# Altium project IR_Sensor_Array.PrjPcb
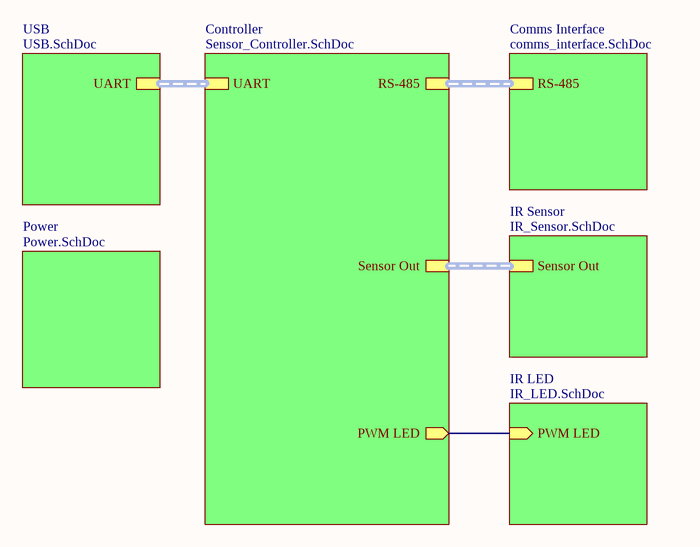
[diagram p0: root.SchDoc]
6 sheets, 81 parts. Net scope: hierarchical (ports join the sheet entries above them; power ports are global).
Board file: PCB.PcbDoc
Sheets:
  root.SchDoc
    Controller = Sensor_Controller.SchDoc
    IR LED = IR_LED.SchDoc
    IR Sensor = IR_Sensor.SchDoc
    Comms Interface = comms_interface.SchDoc
    Power = Power.SchDoc

## Sheet root.SchDoc
size A4; SheetNumber: 1; SheetTotal: 7

### Sub-sheets
Comms Interface = comms_interface.SchDoc: RS-485
Controller = Sensor_Controller.SchDoc: RS-485, Sensor Out, UART, PWM LED (out)
IR LED = IR_LED.SchDoc: PWM LED (in)
IR Sensor = IR_Sensor.SchDoc: Sensor Out
Power = Power.SchDoc: no entries
USB = USB.SchDoc (file not in this document): UART

### Nets
PWM LED: sheet Controller/PWM LED, sheet IR LED/PWM LED

### Buses and harness runs
harness sheet Comms Interface/RS-485 = sheet Controller/RS-485
harness sheet Controller/Sensor Out = sheet IR Sensor/Sensor Out
harness sheet Controller/UART = sheet USB/UART

## Sheet Sensor_Controller.SchDoc
size A4; SheetNumber: 2; SheetTotal: 7
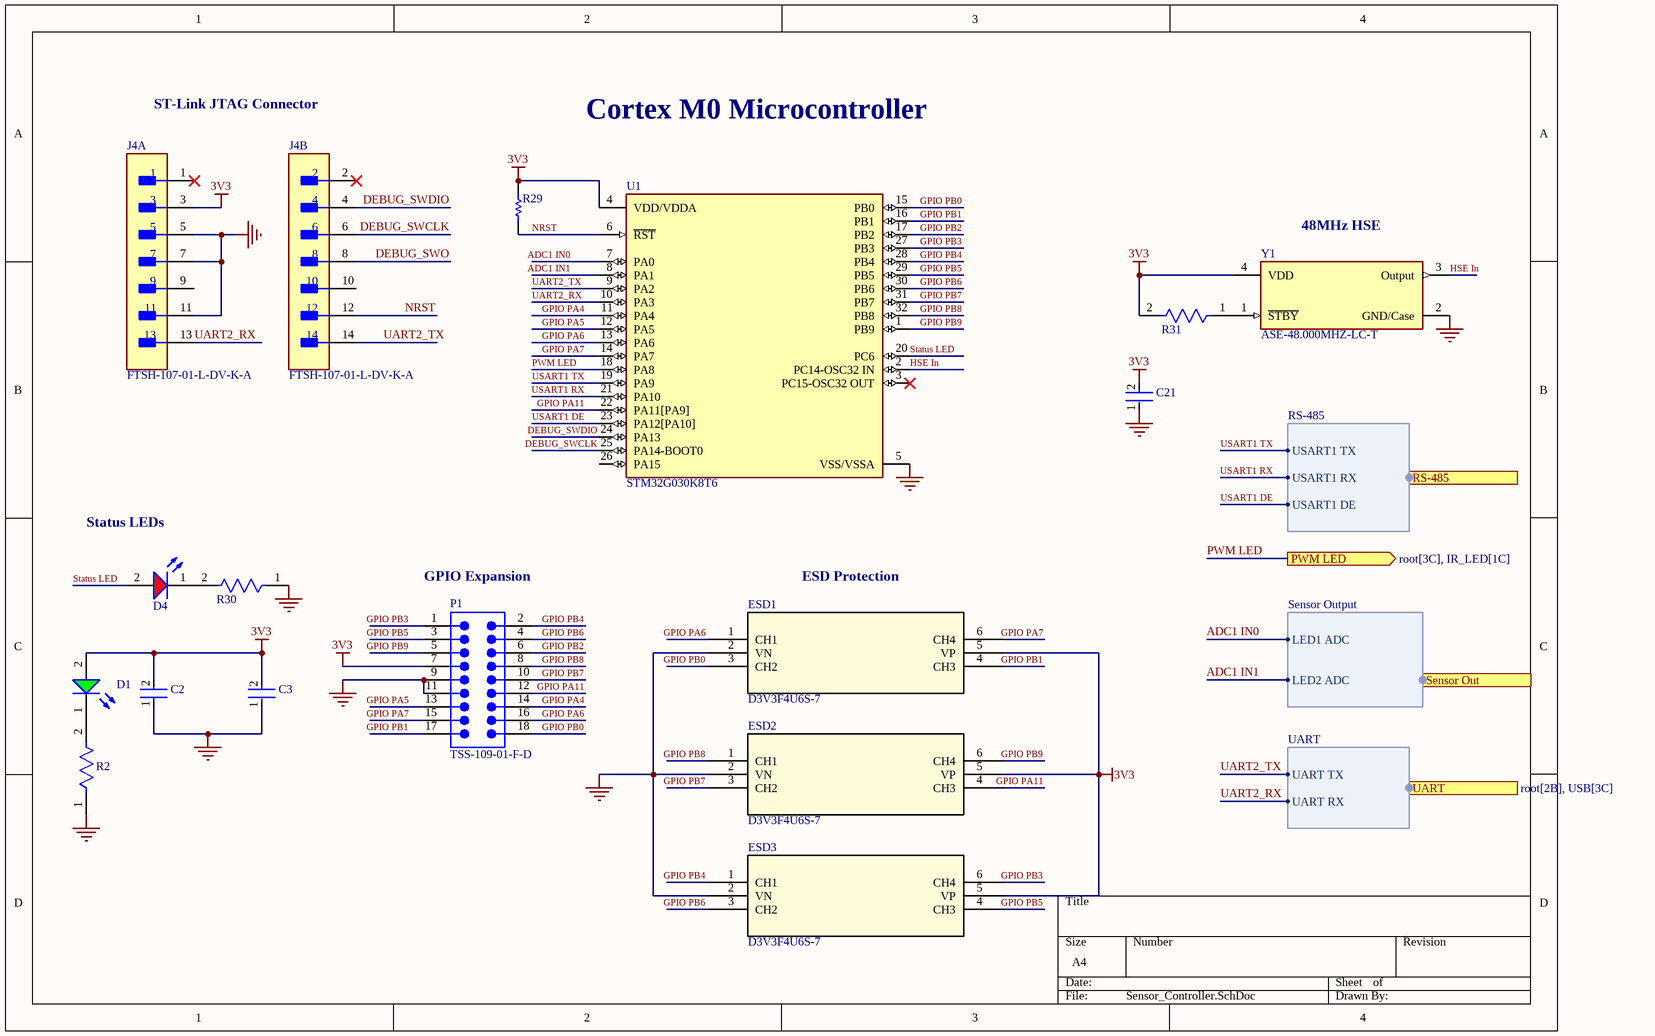
[diagram p1: Sensor_Controller.SchDoc]

### Parts
C2  GRM188R6YA475KE15D  [FP-GRM188-0_2-IPC_C]  (value not drawn)
C3  GRM155R71C104KA88D  [FP-GRM15-MFG]  (value not drawn)
C21  GRM155R71C104KA88D  [FP-GRM15-MFG]  (value not drawn)
D1  150060VS75000  [WL-SMCW_0603_150060xx75000]  (value not drawn)
D4  150060SS75000  [WL-SMCW_0603_150060xx75000]  (value not drawn)
ESD1  D3V3F4U6S-7  [SOT-363_DIO]
ESD2  D3V3F4U6S-7  [SOT-363_DIO]
ESD3  D3V3F4U6S-7  [SOT-363_DIO]
J4  FTSH-107-01-L-DV-K-A  [FP-FTSH-107-01-L-DV-K-A-MFG]  (parts A,B of 2)
P1  TSS-109-01-F-D  [SMTC-TSS-109-01-X-D]
R2  RC0603FR-0710KL  [FP-RC0603-0_55-IPC_C]  (value not drawn)
R29  TNPW040210K0DEED  [RESC1005X40X20NL05T10]  (value not drawn)
R30  RC0603FR-0710KL  [FP-RC0603-0_55-IPC_C]  (value not drawn)
R31  RC0603FR-0710KL  [FP-RC0603-0_55-IPC_C]  (value not drawn)
U1  STM32G030K8T6  [FP-LQFP32-5V-IPC_A]
Y1  ASE-48.000MHZ-LC-T  [FP-ASE-MFG]

### Ports
PWM LED (out, see root[3C], IR_LED[1C]), RS-485 (harness RS-485, see root[3B], comms_interface[1D]), Sensor Out (harness Sensor Output, see root[3B], IR_Sensor[1C]), UART (harness UART, see root[2B], USB[3C])

### Harnesses
Sensor Output: LED1 ADC, LED2 ADC
RS-485: USART1 TX, USART1 RX, USART1 DE
UART: UART TX, UART RX

### Nets
3V3: C2.2 C3.2 C21.2 D1.2(A) ESD1.5(VP) ESD2.5(VP) ESD3.5(VP) J4.3 P1.7 R29.2 R31.2 U1.4(VDD/VDDA) Y1.4(VDD)
GND: C2.1 C3.1 C21.1 ESD1.2(VN) ESD2.2(VN) ESD3.2(VN) J4.5 J4.7 J4.11 P1.9 P1.11 R2.1 R30.1 U1.5(VSS/VSSA) Y1.2(GND/Case)
ADC1 IN0: U1.7(PA0) ; port Sensor Out.LED1 ADC
ADC1 IN1: U1.8(PA1) ; port Sensor Out.LED2 ADC
DEBUG_SWCLK: J4.6 U1.25(PA14-BOOT0)
DEBUG_SWDIO: J4.4 U1.24(PA13)
DEBUG_SWO: J4.8
GPIO PA4: P1.14 U1.11(PA4)
GPIO PA5: P1.13 U1.12(PA5)
GPIO PA6: ESD1.1(CH1) P1.16 U1.13(PA6)
GPIO PA7: ESD1.6(CH4) P1.15 U1.14(PA7)
GPIO PA11: ESD2.4(CH3) P1.12 U1.22(PA11[PA9])
GPIO PB0: ESD1.3(CH2) P1.18 U1.15(PB0)
GPIO PB1: ESD1.4(CH3) P1.17 U1.16(PB1)
GPIO PB2: P1.6 U1.17(PB2)
GPIO PB3: ESD3.6(CH4) P1.1 U1.27(PB3)
GPIO PB4: ESD3.1(CH1) P1.2 U1.28(PB4)
GPIO PB5: ESD3.4(CH3) P1.3 U1.29(PB5)
GPIO PB6: ESD3.3(CH2) P1.4 U1.30(PB6)
GPIO PB7: ESD2.3(CH2) P1.10 U1.31(PB7)
GPIO PB8: ESD2.1(CH1) P1.8 U1.32(PB8)
GPIO PB9: ESD2.6(CH4) P1.5 U1.1(PB9)
HSE In: U1.2(PC14-OSC32_IN) Y1.3(Output)
NRST: J4.12 R29.1 U1.6(~{RST})
PWM LED: U1.18(PA8) ; port PWM LED
Status LED: D4.2(A) U1.20(PC6)
UART2_RX: J4.13 U1.10(PA3) ; port UART.UART RX
UART2_TX: J4.14 U1.9(PA2) ; port UART.UART TX
USART1 DE: U1.23(PA12[PA10]) ; port RS-485.USART1 DE  [project net TX EN]
USART1 RX: U1.21(PA10) ; port RS-485.USART1 RX  [project net RX]
USART1 TX: U1.19(PA9) ; port RS-485.USART1 TX  [project net TX]
NetD1_1: D1.1(K) R2.2
NetD4_1: D4.1(K) R30.2
NetR31_1: R31.1 Y1.1(~{STBY})

Not connected (* = marked no-connect by the designer): J4 1* 2* 9 10; U1 3(PC15-OSC32_OUT)* 26(PA15)

### Notes on the sheet
- ST-Link JTAG Connector
- Cortex M0 Microcontroller
- (near Y1) 48MHz HSE
- Status LEDs
- (near P1) GPIO Expansion
- ESD Protection

### Library data of the parts
C2 = CMP-2006-02545-2: Chip Multilayer Ceramic Capacitors for General Purpose, 0603, 4.7uF, X5R, 15%, 10%, 35V; Lead Free: Lead Free; Max Operating Temperature: 85°C; Case Code (Imperial): 0603; Capacitance: 4.7uF; Width: 0.8mm; Thickness: 0.031inch; Case Code (Metric): 1608; Min Operating Temperature: -55°C; Voltage Rating (DC): 35V; Dielectric: X5R; Voltage: 35V; Packaging: Tape and Reel; Resistor Type: Ceramic; Weight: 0.000222oz; Mount: Surface Mount; Material: Ceramic; Depth: 0.8mm; Tolerance: 10%; REACH SVHC: No SVHC; Case/Package: 0603; Voltage Rating: 35V; Package Quantity: 4000; Height: 0.8mm; Length: 1.6mm; Termination: SMD/SMT
C3 C21 = CMP-2100-03641-2: CAP CER 0.1UF 16V X7R 0402; Manufacturer: Murata; Standoff Height: 0mm; Tolerance: 10%; Voltage Rating: 16Vdc; Material: Ceramic; Capacitance: 0.10μF; Value: 0.10μF; RoHS: TRUE; Manufacturer Part Number: GRM155R71C104KA88D; Temperature Characteristic: X7R; Octopart: https://octopart.com/grm155r71c104ka88d-murata-196880; Digikey Description: CAP CER 0.1UF 16V X7R 0402; Device Class L3: Ceramic Capacitors; Height: 0.55mm; ComponentLink2Description: Datasheet; Temperature Range Low: -55°C; Ipc Land Pattern Name: CAPC10050X219; ComponentLink2URL: https://search.murata.co.jp/Ceramy/image/img/A01X/G101/ENG/GRM155R71H471KA01-01A.pdf; Device Class L1: Passive Components; Lead Free: yes; Category: Cap; Package: GRM15; Temperature: -55°C to +125°C; Device Class L2: Capacitors; Temperature Range High: +125°C; Mouser Description: 0402 0.1 uF 16V ±10 % Tolerance X7R SMT Multilayer Ceramic Capacitor
D1 = CMP-1426-00006-7: WURTH ELEKTRONIK - 150060VS75000 - LED, Green, SMD, 0603, 30 mA, 2 V, 570 nm; Reverse Voltage: 5V; Power Dissipation: 72mW; Dominant Wavelength: 570nm; Peak Wavelength: 572nm; Forward Current: 100mA; Forward Voltage: 2V; Lens Style: Clear, Rectangular; Test Current: 20mA; Max Junction Temperature (Tj): 95°C; Viewing Angle: 140°; Luminous Intensity: 40mcd; Height: 700µm; Width: 800µm; Length: 1.6mm; Mount: Surface Mount; Min Operating Temperature: -40°C; Max Reverse Voltage (DC): 5V; Case Code (Imperial): 0603; Wavelength: 570nm; Color: Green; REACH SVHC: Unknown; RoHS: Compliant; Max Operating Temperature: 85°C; Packaging: Tape and Reel; Case/Package: 0603; Number of Pins: 2; Case Code (Metric): 1608
D4 = CMP-1426-00004-3: Led, Red, 630 Nm, 1.9 V, 30 Ma, 60 Mcd Rohs Compliant: Yes; Dominant Wavelength: 630nm; Lens Style: Clear, Rectangular; Forward Current: 100mA; Test Current: 20mA; Viewing Angle: 140°; Forward Voltage: 1.9V; Peak Wavelength: 645nm; Max Reverse Voltage (DC): 5V; Luminous Intensity: 60mcd; Color: Red; Height: 700µm; Min Operating Temperature: -40°C; Case Code (Imperial): 0603; REACH SVHC: Unknown; RoHS: Compliant; Length: 1.6mm; Case Code (Metric): 1608; Mount: Surface Mount; Wavelength: 630nm; Packaging: Tape and Reel; Max Operating Temperature: 85°C; Width: 800µm; Case/Package: 0603
ESD1-ESD3 = D3V3F4U6S-7: No Description Available; Manufacturer_Name: Diodes Inc; Copyright: Copyright (C) 2026 Ultra Librarian. All rights reserved.; Manufacturer_Part_Number: D3V3F4U6S-7; RefDes: RefDes; Type: Type
J4 = CMP-02766-001414-1: CONN HEADER SMD 14POS 1.27MM; Number of Contacts: 14; Gender: Male; Contact Plating: Gold; Termination: Solder; Lead Free: Lead Free; Contact Material: Bronze; Pitch: 1.27mm; Number of Rows: 2; RoHS Compliant: Yes
P1 = CMP-1024-00304-1: Shrouded .025" SQ Post Header, Through-hole, Vertical, -55 to 125 degC, 2.54 mm Pitch, 18-Pin, Male, RoHS; Manufacturer: Samtec; Pitch: 2.54 mm; PartNumber: TSS-109-01-F-D; PackageReference: TSS-109-01-X-D; Orientation: Vertical; ComponentLink3URL: http://www.samtec.com/documents/webfiles/cpdf/TSS-1XX-XX-XXX-X-XX-XX-MKT.pdf; ComponentLink3Description: Package Specification; ComponentLink2URL: http://www.samtec.com/documents/webfiles/pdf/TSS_TH.PDF; Temperature Range: -55 to 125 degC; ComponentLink2Description: Datasheet; RoHS: True; ComponentLink1Description: Manufacturer URL; DatasheetVersion: F-214; Mounting Technology: Through-hole; ComponentLink1URL: http://www.samtec.com; PackageVersion: AE, 1/1990; PackageDescription: Slim Top Shroud Terminal Strip
R2 R30 R31 = CMP-2100-03664-2: RES 10K OHM 1% 1/10W 0603; Voltage Rating: 75V; Voltage Rating (DC): 50V; Resistance: 10kR; Power Rating: 100mW; Temperature Coefficient: 100ppm/°C; Depth: 0.8mm; Termination: SMD/SMT; Resistor Type: Thick Film; Series: RC; Construction: Rectangular; Features: Moisture Resistant; Packaging: Tape and Reel; Min Operating Temperature: -55°C; Number of Terminations: 2; Lead Pitch: 0.3mm; RoHS Compliant: Yes; Case/Package: 0603; Resistance Tolerance: 1%; Military Standard: Not; Weight: 7.1E-05oz; Number of Pins: 2; Tolerance: 1%; Length: 1.6mm; Case Code (Imperial): 0603; Lead Free: Lead Free; Width: 0.8mm; Max Power Dissipation: 100mW; Height: 0.45mm; Max Operating Temperature: 155°C; Case Code (Metric): 1608; Size Code: 0603
R29 = CMP-2002-01682-1: Manufacturer: Vishay BCcomponents; Part Number: TNPW040210K0DEED
U1 = CMP-12105-000136-1: IC MCU 32BIT 64KB FLASH 32LQFP; RoHS Compliant: Yes
Y1 = CMP-27762-000273-1: XTAL Oscillator 48MHz ±50ppm CMOS 3.3V 4-SMD 3.2mm x 2.5mm; Min Supply Voltage: 3.135V; Max Supply Voltage: 3.465V; Load Capacitance: 15pF; Max Supply Current: 19mA; Series: ASE; Radiation Hardening: No; Lead Free: Lead Free; Package Quantity: 1000; Frequency: 48MHz; Frequency Stability: 50ppm; Case/Package: SMD/SMT; REACH SVHC: No SVHC; Operating Frequency: 48 MHz; Mount: Surface Mount; Min Operating Temperature: -40°C; Packaging: Tape and Reel; Max Operating Temperature: 85°C; Depth: 2.5mm; Height: 0.047inch; Width: 0.098inch; Length: 3.2mm; Termination: SMD/SMT; Number of Pins: 4; Operating Supply Voltage: 3.3V

## Sheet IR_LED.SchDoc
size A4; SheetNumber: 3; SheetTotal: 7
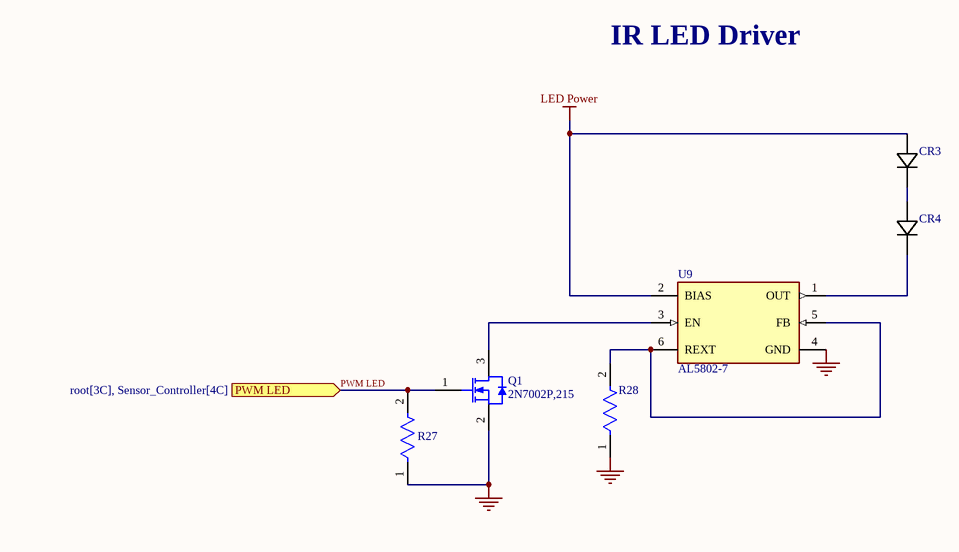
[diagram p2: IR_LED.SchDoc]

### Parts
(Parts that share a designator on the sheet are numbered #1, #2 ... from top to bottom, then left to right.)
CR3  VSMY2940GX01  [DIODE_VSMY2940GX01_VIS]  (value not drawn)
CR4  VSMY2940GX01  [DIODE_VSMY2940GX01_VIS]  (value not drawn)
Q1  2N7002P,215  [NXP-SOT23_L]
R27  RC0603FR-0710KL  [FP-RC0603-0_55-IPC_C]  (value not drawn)
R28  RT0402BRE0733RL  [FP-RT0402-MFG]  (value not drawn)
U9#1  AL5802-7  [Diodes_SOT26_SC74R_MFG]

### Ports
PWM LED (in, see root[3C], Sensor_Controller[4C])

### Nets
GND: Q1.2(S) R27.1 R28.1 U9#1.4(GND)
LED Power: CR3.2 U9#1.2(BIAS)
PWM LED: Q1.1(G) R27.2 ; port PWM LED
NetCR3_1: CR3.1 CR4.2
NetCR4_1: CR4.1 U9#1.1(OUT)
NetQ1_3: Q1.3(D) U9#1.3(EN)
NetR28_2: R28.2 U9#1.5(FB) U9#1.6(REXT)

### Notes on the sheet
- IR LED Driver

### Library data of the parts
CR3 CR4 = VSMY2940GX01: No Description Available; Mfr_Name: Vishay
Q1 = CMP-1259-00082-1: N-Channel Trench MOSFET, 60 V, 0.36 A, -55 to 150 degC, 3-Pin SOT23, Tape and Reel; Manufacturer: NXP Semiconductors; Channel Type: N; Automotive Qualified: Y; VDS [max] (V): 60; Packing: Tape & Reel; ID [max] (A): 0.36; VGSth [typ] (V): 1.75; IDM [max] (A): 1.2; ComponentLink2URL: http://www.nxp.com/documents/data_sheet/2N7002P.pdf; PackageReference: SOT23; PackageVersion: 06-03-16, 03/2006; ComponentLink1URL: http://www.nxp.com/; ComponentLink2Description: Datasheet; Mounting Technology: Surface Mount; PackageDescription: 3-Pin Small Outline Transistor Package, Body 2.9 x 1.3 mm, Pitch 0.95 mm; Code_JEDEC: TO-236AB; ComponentLink1Description: Manufacturer URL; PartNumber: 2N7002P,215; ComponentLink3Description: Package Specification; DatasheetVersion: Rev. 02; ComponentLink3URL: http://www.nxp.com/documents/outline_drawing/sot023_po.pdf
R27 = CMP-2100-03664-2: as R2 on sheet Sensor_Controller; Depth: 0.8mm; Termination: SMD/SMT; Resistor Type: Thick Film; Series: RC; Construction: Rectangular; Features: Moisture Resistant; Packaging: Tape and Reel; Min Operating Temperature: -55°C; Number of Terminations: 2; Lead Pitch: 0.3mm; RoHS Compliant: Yes; Case/Package: 0603; Resistance Tolerance: 1%; Military Standard: Not; Weight: 7.1E-05oz; Number of Pins: 2; Tolerance: 1%; Length: 1.6mm; Case Code (Imperial): 0603; Lead Free: Lead Free; Width: 0.8mm; Max Power Dissipation: 100mW; Height: 0.45mm; Max Operating Temperature: 155°C; Case Code (Metric): 1608; Size Code: 0603
R28 = CMP-2002-02979-2: RES SMD 33 OHM 0.1% 1/16W 0402; Manufacturer: Yageo; Power Rating: 0.063W; Temperature Coefficient: 50 ppm/°C; Tolerance: 0.001; Resistance: 33Ω; Value: 33Ω; Voltage Rating: 50V; Lead Free: Yes; Temperature Range Low: -55°C; ComponentLink2Description: Datasheet; Device Class L2: Resistors; Footprint Url: http://www.yageo.com/exep/pages/download/literatures/PYu-R_Mount_10.pdf; Temperature: -55°C to +155°C; Automotive: No; Manufacturer Part Number: RT0402BRE0733RL; Series: RT; Device Class L3: Chip SMD Resistors; Height: 0.35mm; Digikey Description: RES SMD 33 OHM 0.1% 1/16W 0402; Octopart: https://octopart.com/rt0402bre0733rl-yageo-1202878; Package: RT0402; ComponentLink2URL: http://www.yageo.com/documents/recent/PYu-RT_1-to-0.01_RoHS_L_9.pdf; Composition: Thin Film; Category: Res; Ipc Land Pattern Name: RESC10050X30; Device Class L1: Passive Components; RoHS: TRUE; Temperature Range High: +155°C
U9#1 = CMP-2000-05770-2: Manufacturer Package Identifier: SOT26 (SC74R); NexarPartId: 21363776; Output Voltage: 30V; Max Power Dissipation: 370mW; Output Current: 150mA; Nominal Supply Current: 120mA; Number of Channels: 2; Power Dissipation: 1W; Min Input Voltage (DC): 4.5V; Output Type: Adjustable; Number of Outputs: 1; Max Junction Temperature (Tj): 150°C; Dimming: PWM; Weight: 29.993795mg; Max Input Voltage (DC): 30V; RoHS: Compliant; Radiation Hardening: No; Max Operating Temperature: 125°C; Mount: Surface Mount; Height: 1.3mm; Lead Free: Lead Free; Case/Package: SOT-26; Width: 1.7mm; Ambient Temperature Range High: 125°C; Max Input Voltage: 30V; Number of Pins: 6; Max Supply Current: 120mA; REACH SVHC: No SVHC; Min Input Voltage: 4.5V; Schedule B: 8542390000, 8542390000; Max Supply Voltage: 30V; Min Supply Voltage: 4.5V; Contact Plating: Tin; Output Current per Channel: 120mA; Min Operating Temperature: -40°C; Length: 3.1mm

## Sheet IR_Sensor.SchDoc
size A4; SheetNumber: 4; SheetTotal: 7
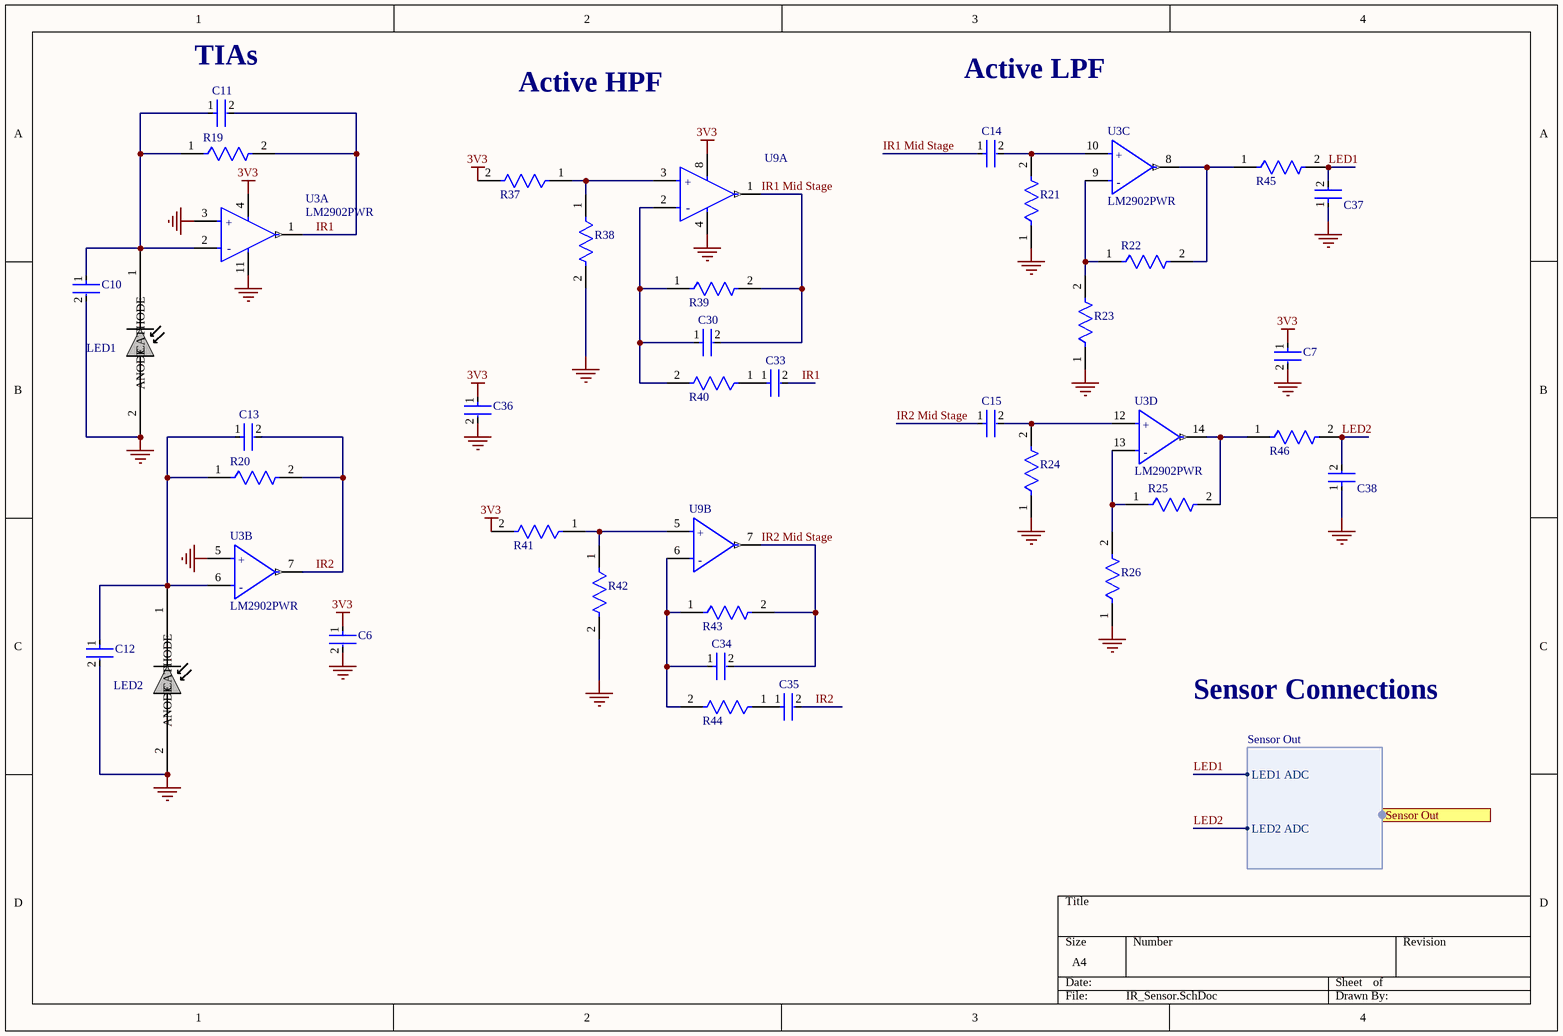
[diagram p3: IR_Sensor.SchDoc]

### Parts
(Parts that share a designator on the sheet are numbered #1, #2 ... from top to bottom, then left to right.)
C6  LMK105B7104KVHF  [FP-0402-L_1_0_0_05-W_0_5-IPC_B]  (value not drawn)
C7  LMK105B7104KVHF  [FP-0402-L_1_0_0_05-W_0_5-IPC_B]  (value not drawn)
C10  GCM1555C1H4R0CA16D  [FP-GCM155-0_05-MFG]  (value not drawn)
C11  C0603C100D5GACAUTO  [FP-C0603C-CF-MFG]  (value not drawn)
C12  GCM1555C1H4R0CA16D  [FP-GCM155-0_05-MFG]  (value not drawn)
C13  C0603C100D5GACAUTO  [FP-C0603C-CF-MFG]  (value not drawn)
C14  C0603C104K3RACTU  [FP-C0603C-CF-MFG]  (value not drawn)
C15  C0603C104K3RACTU  [FP-C0603C-CF-MFG]  (value not drawn)
C30  C0603C100D5GACAUTO  [FP-C0603C-CF-MFG]  (value not drawn)
C33  C0603C104K3RACTU  [FP-C0603C-CF-MFG]  (value not drawn)
C34  C0603C100D5GACAUTO  [FP-C0603C-CF-MFG]  (value not drawn)
C35  C0603C104K3RACTU  [FP-C0603C-CF-MFG]  (value not drawn)
C36  LMK105B7104KVHF  [FP-0402-L_1_0_0_05-W_0_5-IPC_B]  (value not drawn)
C37  C0603C104K3RACTU  [FP-C0603C-CF-MFG]  (value not drawn)
C38  C0603C104K3RACTU  [FP-C0603C-CF-MFG]  (value not drawn)
LED1  VEMD2020X01  [6p544-5383p02-4_VIS]  (value not drawn)
LED2  VEMD2020X01  [6p544-5383p02-4_VIS]  (value not drawn)
R19  MCT0603MD1002DP500  [FP-MCT0603-IPC_A]  (value not drawn)
R20  MCT0603MD1002DP500  [FP-MCT0603-IPC_A]  (value not drawn)
R21  AC0603JR-0747KL  [FP-AC0603-IPC_A]  (value not drawn)
R22  RT0603DRE073K3L  [FP-RT0603-MFG]  (value not drawn)
R23  AT0603BRD071KL  [FP-AT0603-IPC_A]  (value not drawn)
R24  AC0603JR-0747KL  [FP-AC0603-IPC_A]  (value not drawn)
R25  RT0603DRE073K3L  [FP-RT0603-MFG]  (value not drawn)
R26  AT0603BRD071KL  [FP-AT0603-IPC_A]  (value not drawn)
R37  CRCW0603100KFKEI  [FP-CRCW0603-e3-MFG]  (value not drawn)
R38  CRCW0603100KFKEI  [FP-CRCW0603-e3-MFG]  (value not drawn)
R39  CRCW0603100KFKEI  [FP-CRCW0603-e3-MFG]  (value not drawn)
R40  AC0603JR-7W10KL  [FP-AC0603-IPC_A]  (value not drawn)
R41  CRCW0603100KFKEI  [FP-CRCW0603-e3-MFG]  (value not drawn)
R42  CRCW0603100KFKEI  [FP-CRCW0603-e3-MFG]  (value not drawn)
R43  CRCW0603100KFKEI  [FP-CRCW0603-e3-MFG]  (value not drawn)
R44  AC0603JR-7W10KL  [FP-AC0603-IPC_A]  (value not drawn)
R45  CRCW0603100KFKEI  [FP-CRCW0603-e3-MFG]  (value not drawn)
R46  CRCW0603100KFKEI  [FP-CRCW0603-e3-MFG]  (value not drawn)
U3  LM2902PWR  [FP-PW0014A-IPC_C]  (parts A,B,C,D of 4)
U9#2  LMV358AIDR  [FP-D0008A-IPC_C]  (value not drawn)  (parts A,B of 2)

### Ports
Sensor Out (harness Sensor Out, see root[3B], Sensor_Controller[4C])

### Harnesses
Sensor Out: LED2 ADC, LED1 ADC

### Nets
3V3: C6.1 C7.1 C36.1 R37.2 R41.2 U3.4(VCC) U9#2.8(V+)
GND: C6.2 C7.2 C10.2 C12.2 C36.2 C37.1 C38.1 LED1.2(ANODE) LED2.2(ANODE) R21.1 R23.1 R24.1 R26.1 R38.2 R42.2 U3.3(1IN+) U3.5(2IN+) U3.11(GND) U9#2.4(V-)
IR1: C11.2 C33.2 R19.2 U3.1(1OUT)
IR1 Mid Stage: C14.1 C30.2 R39.2 U9#2.1(OUT_A)
IR2: C13.2 C35.2 R20.2 U3.7(2OUT)
IR2 Mid Stage: C15.1 C34.2 R43.2 U9#2.7(OUT_B)
LED1: C37.2 R45.2 ; port Sensor Out.LED1 ADC  [project net ADC1 IN0]
LED2: C38.2 R46.2 ; port Sensor Out.LED2 ADC  [project net ADC1 IN1]
NetC10_1: C10.1 C11.1 LED1.1(CATHODE) R19.1 U3.2(1IN-)
NetC12_1: C12.1 C13.1 LED2.1(CATHODE) R20.1 U3.6(2IN-)
NetC14_2: C14.2 R21.2 U3.10(3IN+)
NetC15_2: C15.2 R24.2 U3.12(4IN+)
NetC30_1: C30.1 R39.1 R40.2 U9#2.2(-IN_A)
NetC33_1: C33.1 R40.1
NetC34_1: C34.1 R43.1 R44.2 U9#2.6(-IN_B)
NetC35_1: C35.1 R44.1
NetR22_1: R22.1 R23.2 U3.9(3IN-)
NetR22_2: R22.2 R45.1 U3.8(3OUT)
NetR25_1: R25.1 R26.2 U3.13(4IN-)
NetR25_2: R25.2 R46.1 U3.14(4OUT)
NetR37_1: R37.1 R38.1 U9#2.3(+IN_A)
NetR41_1: R41.1 R42.1 U9#2.5(+IN_B)

### Notes on the sheet
- (near C11) TIAs
- Active HPF
- Active LPF
- Sensor Connections
- (in symbol CMP-04895-000145-1, part A) +; -
- (in symbol CMP-04895-000145-1, part B) +; -
- (in symbol CMP-04895-000145-1, part C) +; -
- (in symbol CMP-04895-000145-1, part D) +; -
- (in symbol CMP-04895-000233-1, part A) +; -
- (in symbol CMP-04895-000233-1, part B) +; -

### Library data of the parts
C6 C7 C36 = CMP-14477-001294-2: None; Tolerance: 10%; Voltage Rating: 10V; Capacitance: 100nF; Lead Free: Lead Free; Case/Package: 0402; Length: 0.039inch; Thickness: 0.022inch; Halogen Free: Halogen Free; Mount: Surface Mount; Packaging: Tape and Reel; Width: 0.02inch; Case Code (Metric): 1005; Voltage Rating (DC): 10V; Case Code (Imperial): 0402; Min Operating Temperature: -55°C; RoHS Compliant: Yes; Max Operating Temperature: 125°C; Ratings: AEC-Q200
C10 C12 = CMP-06035-062171-1: Ceramic Capacitor for Automotive 4pF ±0.25pF 50VDC C0G 0402 Paper T/R; Voltage Rating: 50V; Mount: Surface Mount; Min Operating Temperature: -55°C; Package Quantity: 10000; Case/Package: 0402; Case Code (Imperial): 0402; Thickness: 0.022inch; Dielectric: C0G; Length: 0.039inch; Ratings: AEC-Q200; Max Operating Temperature: 125°C; Voltage Rating (DC): 50V; Packaging: Tape and Reel; RoHS Compliant: Yes; Termination: SMD/SMT; Weight: 0.000212oz; Capacitance: 4pF; Case Code (Metric): 1005; Width: 0.02inch; Height: 0.5mm
C11 C13 C30 C34 = CMP-03020-010987-1: C0603 10 pF C0G 30ppm/°C 0.5 pF 50 V; Manufacturer: KEMET; Tolerance: 0.5 pF; Automotive Grade: Grade 1; Value: 10 pF; Material: Ceramic; Voltage Rating: 50 V; ComponentLink2URL: https://api.kemet.com/component-edge/download/datasheet/C0603C100J5GACAUTO.pdf; Manufacturer Part Number: C0603C100D5GACAUTO; Temperature Range High: +125°C; Height: 0.87mm; Device Class L3: Ceramic Capacitors; Octopart: https://octopart.com/c0603c100d5gacauto-kemet-81425946; RoHS: TRUE; Temperature: -55°C to +125°C; Lead Free: Yes; Temperature Characteristic: C0G; Category: Cap; ComponentLink2Description: Datasheet; Capacitance: 10 pF; Device Class L2: Capacitors; Temperature Coefficient: 30ppm/°C; Device Class L1: Passive Components; Automotive: Yes; Package: C0603C-CF; Temperature Range Low: -55°C
C14 C15 C33 C35 C37 C38 = CMP-2006-03057-2: CAP CER 0.1UF 25V X7R 0603; Manufacturer: KEMET; Value: 0.10 μF; Material: Ceramic; Tolerance: 0.1; Temperature Coefficient: 30ppm/°C; Automotive Grade: Grade 1; Lead Free: Yes; Device Class L3: Ceramic Capacitors; Voltage Rating: 25 V; Manufacturer Part Number: C0603C104K3RACTU; Digikey Description: CAP CER 0.1UF 25V X7R 0603; Mouser Description: Multilayer Ceramic Capacitors MLCC - SMD/SMT 25volts 0.1uF X7R 10%; Package: C0603C-CF; Temperature Range Low: -55°C; Automotive: Yes; Device Class L2: Capacitors; Octopart: https://octopart.com/c0603c104k3ractu-kemet-127541; ComponentLink2Description: Datasheet; ComponentLink2URL: https://api.kemet.com/component-edge/download/datasheet/C0603C100J5GACAUTO.pdf; Temperature Range High: +125°C; RoHS: TRUE; Device Class L1: Passive Components; Category: Cap; Temperature: -55°C to +125°C; Capacitance: 0.10 μF; Height: 0.87mm; Temperature Characteristic: X7R
LED1 LED2 = VEMD2020X01: No Description Available; Mfr_Name: Vishay; RefDes: RefDes; Type: Type
R19 R20 = CMP-02407-010942-1: RES SMD 100 OHM 1% 1/8W 0603; Power Rating: 125mW; Resistance: 10kR; Tolerance: 0.5%; Temperature Coefficient: 25ppm/°C; Max Power Dissipation: 150mW; Voltage Rating: 75V; Case Code (Imperial): 0603; Case Code (Metric): 1608; Military Standard: Not; Lead Free: Lead Free; Max Operating Temperature: 175°C; Length: 1.55mm; Height: 0.022inch; Min Operating Temperature: -55°C; Width: 0.8mm; Package Quantity: 1; Contact Plating: Tin; Termination: Wraparound; Composition: Thin Film; Case/Package: 0603; Number of Terminations: 2; Depth: 0.85mm; Features: Automotive AEC-Q200; Mount: Surface Mount; Voltage Rating (DC): 75V; Packaging: Tape and Reel; REACH SVHC: No SVHC
R21 R24 = CMP-03412-049221-1: RES 47kΩ 5.00% 0.1W 0603; Resistance: 47kR; Tolerance: 5%; Temperature Coefficient: 100ppm/°C; Max Power Dissipation: 100mW; Voltage Rating: 50V; Packaging: Tape and Reel; Series: AC; Ratings: AEC-Q200; Case Code (Metric): 1608; Case Code (Imperial): 0603; Resistor Type: Thick Film; Max Operating Temperature: 155°C; Case/Package: 0603; Features: Moisture Resistant; Height: 0.45mm; Termination: SMD/SMT; Length: 1.6mm; Min Operating Temperature: -55°C; Number of Terminations: 2; Width: 0.8mm; RoHS Compliant: Yes; Power Rating: 100mW
R22 R25 = CMP-03412-032896-1: RES 3.30K OHM 1/10W .5% SMD 0603; Manufacturer: Yageo; Resistance: 3.3KΩ; Value: 3.3KΩ; Voltage Rating: 75V; Power Rating: 0.1W; Tolerance: 0.005; Temperature Coefficient: 50 ppm/°C; Composition: Thin Film; Ipc Land Pattern Name: RESC16080X45; ComponentLink2URL: http://www.yageo.com/documents/recent/PYu-RT_1-to-0.01_RoHS_L_9.pdf; Mouser Description: High Precision-High Stability Chip Resistor Thin Film 0603 3.3kOhm 0.5% Paper T/R; Automotive: No; Temperature Range High: +155°C; Device Class L3: Chip SMD Resistors; RoHS: TRUE; Lead Free: Yes; Octopart: https://octopart.com/rt0603dre073k3l-yageo-1479702; Series: RT; Digikey Description: RES 3.30K OHM 1/10W .5% SMD 0603; Device Class L2: Resistors; Manufacturer Part Number: RT0603DRE073K3L; Temperature Range Low: -55°C; Package: RT0603; Category: Res; Footprint Url: http://www.yageo.com/exep/pages/download/literatures/PYu-R_Mount_10.pdf; Temperature: -55°C to +155°C; ComponentLink2Description: Datasheet; Height: 0.55mm; Device Class L1: Passive Components
R23 R26 = CMP-03412-045054-1: Thin Film Chip Resistors Automotive Grade 1kΩ 0.1% 25ppm/°C 0603; Resistance: 1kR; Max Power Dissipation: 100mW; RoHS Compliant: Yes; Case Code (Metric): 1608; Features: Moisture Resistant; Tolerance: 0.1%; Case/Package: 0603; Temperature Coefficient: 25ppm/°C; Height: 0.022inch; Max Operating Temperature: 155°C; Width: 0.032inch; Ratings: AEC-Q200; Series: AT; Length: 0.063inch; Case Code (Imperial): 0603; Packaging: Cut Tape; Resistor Type: Thin Film; Number of Terminations: 2; Min Operating Temperature: -55°C
R37-R39 R41-R43 R45 R46 = CMP-02407-005189-1: RES Thick Film, 100kΩ, 1%, 0.1W, 100ppm/°C, 0603; Resistance: 100kR; Max Power Dissipation: 100mW; Number of Terminations: 2; Temperature Coefficient: 100ppm/°C; Composition: Thick Film; Max Operating Temperature: 155°C; Packaging: Tape and Reel; Lead Free: Lead Free; Min Operating Temperature: -55°C; Case/Package: 0603; Tolerance: 1%; Height: 0.02inch; Length: 0.061inch; Package Quantity: 5000; Width: 0.033inch; Features: Automotive AEC-Q200
R40 R44 = CMP-03412-040683-1: RES 10kΩ 5.00% 0.2W 0603
U3 = CMP-04895-000145-1: IC OPAMP GP 4 CIRCUIT 14TSSOP; Min Supply Voltage: 3V; Operating Supply Voltage: 13V; Unity Gain Bandwidth Product: 1.2MHz; Slew Rate: 0.5V/µs; Dual Supply Voltage: 9V; Voltage Gain: 100dB; Common Mode Rejection Ratio: 50dB; Input Offset Voltage (Vos): 7mV; Operating Supply Current: 1.4mA; Min Dual Supply Voltage: 1.5V; Number of Channels: 4; Output Current per Channel: 60mA; Output Current: 30mA; Nominal Supply Current: 3mA; Input Bias Current: 250nA; Max Supply Voltage: 26V; Min Operating Temperature: -40°C; Max Operating Temperature: 125°C; Mount: Surface Mount; REACH SVHC: No SVHC; Max Dual Supply Voltage: 13V; Lead Free: Lead Free; Number of Pins: 14; Length: 5mm; Width: 4.4mm; Gain Bandwidth Product: 1.2MHz; Height: 1.15mm; Radiation Hardening: No; Package Quantity: 1; Number of Circuits: 4; Packaging: Tape and Reel; Bandwidth: 1.2MHz; Case/Package: TSSOP; Number of Amplifiers: 4; Number of Elements: 4
U9#2 = CMP-04895-000233-1: IC OPAMP GP 2 CIRCUIT 8SOIC; Gain Bandwidth Product: 1MHz; Number of Channels: 2; Input Offset Voltage (Vos): 1mV; Operating Supply Current: 80uA; Input Bias Current: 10pA; Slew Rate: 1.7V/µs; Min Operating Temperature: -40°C; Number of Circuits: 2; Packaging: Cut Tape; Case/Package: SOIC; RoHS Compliant: Yes; Number of Pins: 8; Mount: Surface Mount; Max Operating Temperature: 125°C

## Sheet comms_interface.SchDoc
size A4; SheetNumber: 5; SheetTotal: 7
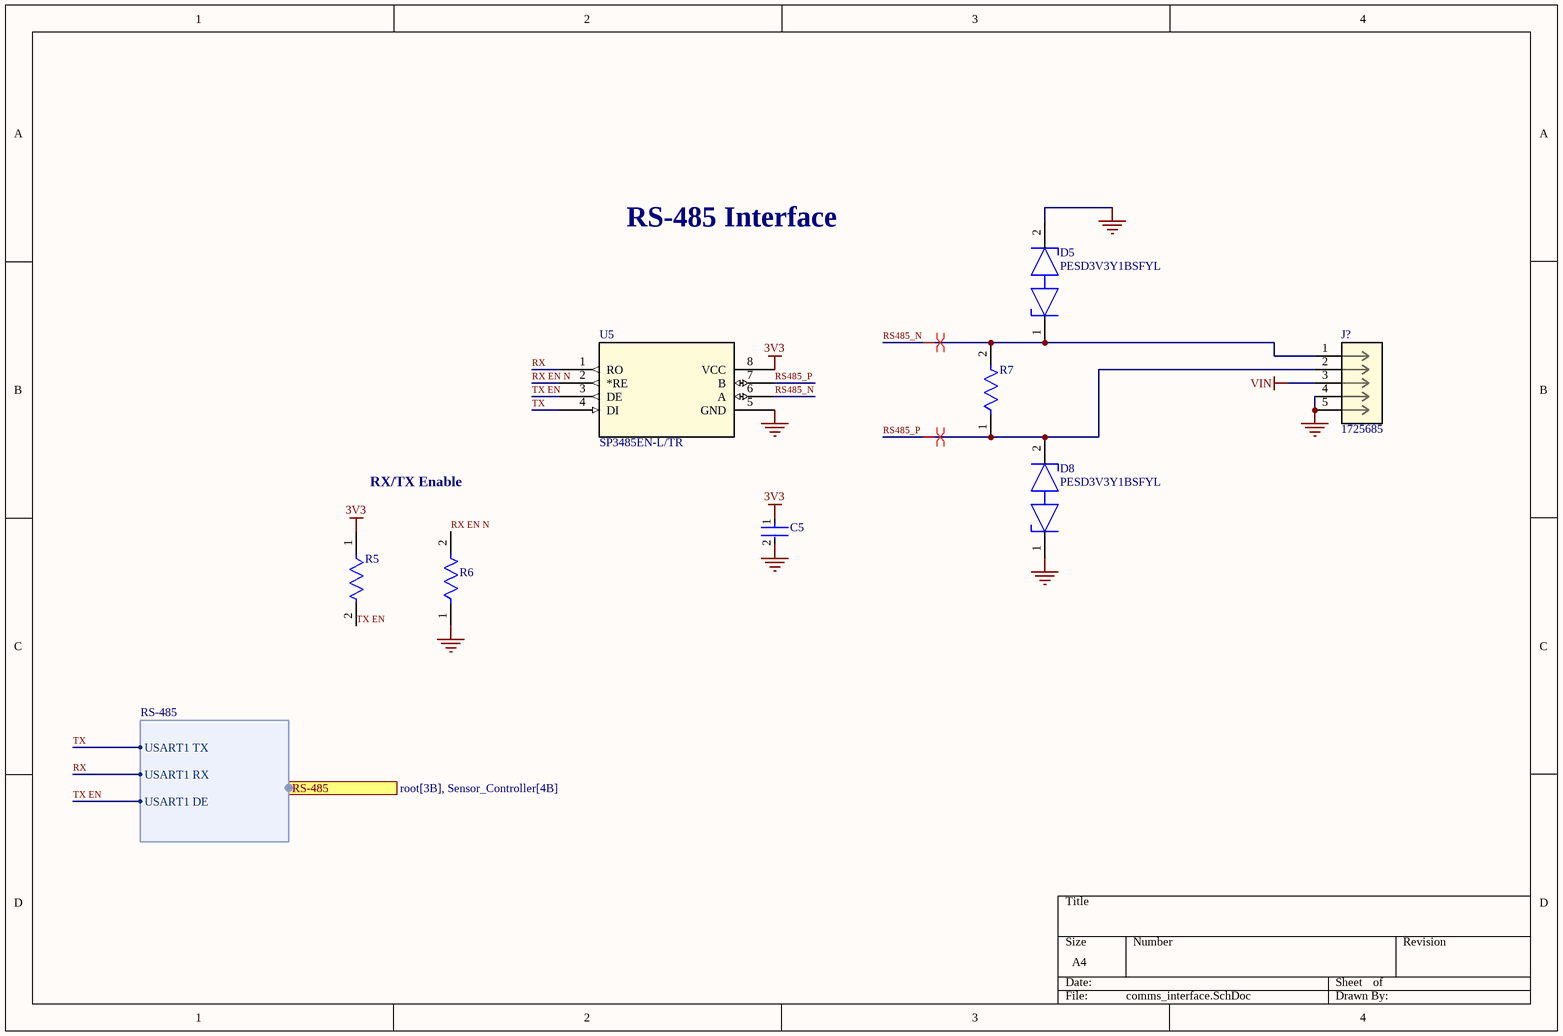
[diagram p4: comms_interface.SchDoc]

### Parts
C5  LMK105B7104KVHF  [FP-0402-L_1_0_0_05-W_0_5-IPC_B]  (value not drawn)
D5  PESD3V3Y1BSFYL  [FP-SOD962-2-CA-MFG]
D8  PESD3V3Y1BSFYL  [FP-SOD962-2-CA-MFG]
J?  1725685  [CONN_1725685_PXC]
R5  AF0402FR-073K3L  [FP-AF0402-IPC_B]  (value not drawn)
R6  AF0402FR-073K3L  [FP-AF0402-IPC_B]  (value not drawn)
R7  AF0402FR-07120RL  [FP-AF0402-IPC_A]  (value not drawn)
U5  SP3485EN-L/TR  [NSOIC-8]

### Ports
RS-485 (harness RS-485, see root[3B], Sensor_Controller[4B])

### Harnesses
RS-485: USART1 TX, USART1 RX, USART1 DE

### Nets
3V3: C5.1 R5.1 U5.8(VCC)
GND: C5.2 D5.2 D8.1 J?.4 J?.5 R6.1 U5.5(GND)
VIN: J?.3
RS485_N: D5.1 J?.1 R7.2 U5.6(A)
RS485_P: D8.2 J?.2 R7.1 U5.7(B)
RX: U5.1(RO) ; port RS-485.USART1 RX
RX EN N: R6.2 U5.2(*RE)
TX: U5.4(DI) ; port RS-485.USART1 TX
TX EN: R5.2 U5.3(DE) ; port RS-485.USART1 DE

### Layout directives
differential pair: RS485_N, RS485_P

### Notes on the sheet
- RS-485 Interface
- RX/TX Enable

### Library data of the parts
C5 = CMP-14477-001294-2: as C6 on sheet IR_Sensor; Lead Free: Lead Free; Case/Package: 0402; Length: 0.039inch; Thickness: 0.022inch; Halogen Free: Halogen Free; Mount: Surface Mount; Packaging: Tape and Reel; Width: 0.02inch; Case Code (Metric): 1005; Voltage Rating (DC): 10V; Case Code (Imperial): 0402; Min Operating Temperature: -55°C; RoHS Compliant: Yes; Max Operating Temperature: 125°C; Ratings: AEC-Q200
D5 D8 = CMP-11424-92175759-2: PESD3V3Y1BSFYL PESD4V0Y1BSF - Extremely low capacitance bidirectional ESD protection diode; Manufacturer Lifecycle Status: RELEASED FOR SUPPLY; Number of Channels: 1; Breakdown Voltage: 4.2V; Clamping Voltage: 3.7V; Capacitance: 240fF; Reverse Standoff Voltage: 3.3V; Height: 320µm; RoHS: Non-Compliant; Ambient Temperature Range High: 125°C; NexarPartId: 92175759; Direction: Bidirectional; Lifecycle Status: Production; Schedule B: 8536300000
J? = 1725685: PCB terminal block, nominal current: 6 A, rated voltage (III/2): 160 V, nominal cross section: 0.5 mmÂ², number of potentials: 5, number of rows: 1, number of positions per row: 5, product range: MPT 0,5, pitch: 2.54 mm, connection method: Screw connection with tension sleeve, screw head form: L Slotted, mounting: Wave soldering, conductor/PCB connection direction: 0 Â°, color: green, Pin layout: Linear pinning, Solder pin [P]: 3.5 mm, number of solder pins per potential: 1, type of packaging: packed in cardboard; Manufacturer_Name: Phoenix Contact; Copyright: Copyright (C) 2026 Ultra Librarian. All rights reserved.; Manufacturer_Part_Number: 1725685; RefDes: RefDes; Type: Type
R5 R6 = CMP-03412-043110-1: Anti-Sulfurated Chip Resistors Automotive Grade 3.3kΩ 1% 100ppm/°C 0402; Max Power Dissipation: 63mW; Resistance: 3.3kR; Length: 0.039inch; Min Operating Temperature: -55°C; Case/Package: 0402; Width: 0.02inch; Height: 0.015inch; Resistor Type: Thick Film; Max Operating Temperature: 155°C; Temperature Coefficient: 100ppm/°C; RoHS Compliant: Yes; Features: Moisture Resistant; Series: AF; Number of Terminations: 2; Tolerance: 1%; Packaging: Tape and Reel
R7 = CMP-03412-046039-1: Anti-Sulfurated Chip Resistors Automotive Grade 120Ω 1% 100ppm/°C 0402; Resistance: 120R; Max Power Dissipation: 63mW; RoHS Compliant: Yes; Resistor Type: Thick Film; Length: 0.039inch; Case/Package: 0402; Temperature Coefficient: 100ppm/°C; Number of Terminations: 2; Packaging: Tape and Reel; Min Operating Temperature: -55°C; Height: 0.015inch; Tolerance: 1%; Max Operating Temperature: 155°C; Features: Moisture Resistant; Width: 0.02inch; Series: AF
U5 = SP3485EN-LTR: No Description Available; Manufacturer_Name: MaxLinear / Exar; Copyright: Copyright (C) 2026 Ultra Librarian. All rights reserved.; Manufacturer_Part_Number: SP3485EN-L/TR; RefDes: RefDes; Type: Type

## Sheet Power.SchDoc
size A4; SheetNumber: 6; SheetTotal: 7
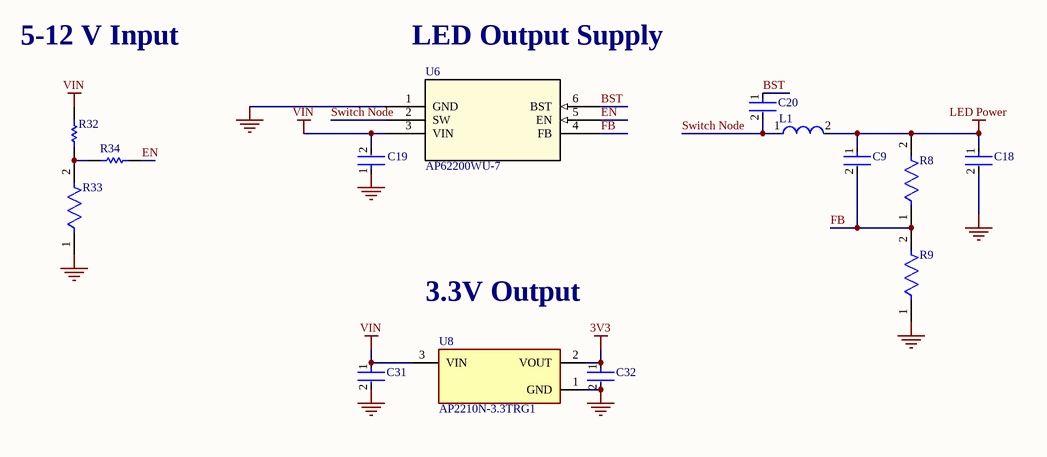
[diagram p5: Power.SchDoc]

### Parts
C9  UMK105CG330JVHF  [FP-0402-L_1_0_0_05-W_0_5-MFG]  (value not drawn)
C18  EMK316BB7226ML-T  [FP-1206-L_3_2_0_3-W_1_6_0-IPC_A]  (value not drawn)
C19  GRM188R6YA475KE15D  [FP-GRM188-0_2-IPC_C]  (value not drawn)
C20  GRM155R71C224KA12D  [FP-GRM155-0_05-IPC_C]  (value not drawn)
C31  GCM21BR71H105MA03L  [FP-GCM21B-0_15-MFG]  (value not drawn)
C32  GCJ21BR71E225KA01L  [FP-GCJ21B-0_3-MFG]  (value not drawn)
L1  LQM21PN1R0NGRD  [FP-LQM21PH_G0-IPC_C]  (value not drawn)
R8  AC0402JR-07200KL  [FP-AC0402-IPC_B]  (value not drawn)
R9  RK73H1ERTTP4422F  [FP-RK73H1E-IPC_C]  (value not drawn)
R32  ERJ-2GEJ204X  [RESC1005X40X25NL05T05]  (value not drawn)
R33  CRCW040250K0FKED  [FP-CRCW0402-e3-IPC_A]  (value not drawn)
R34  RC0402JR-100RL  [RESC1005X40X25NL05T10]  (value not drawn)
U6  AP62200WU-7  [TSOT26-WU_DIO]
U8  AP2210N-3.3TRG1  [FP-SOT23-IPC_C]

### Nets
3V3: C32.1 U8.2(VOUT)
GND: C18.2 C19.1 C31.2 C32.2 R9.1 R33.1 U6.1(GND) U8.1(GND)
LED Power: C9.1 C18.1 L1.2 R8.2
VIN: C19.2 C31.1 R32.2 U6.3(VIN) U8.3(VIN)
BST: C20.1 U6.6(BST)
EN: R34.2 U6.5(EN)
FB: C9.2 R8.1 R9.2 U6.4(FB)
Switch Node: C20.2 L1.1 U6.2(SW)
NetR32_1: R32.1 R33.2 R34.1

### Notes on the sheet
- 5-12 V Input
- LED Output Supply
- 3.3V Output

### Library data of the parts
C9 = CMP-14477-003555-2: None; Voltage Rating (DC): 50V; Tolerance: 5%; Capacitance: 33pF; Mount: Surface Mount; Case Code (Imperial): 0402; Min Operating Temperature: -55°C; Package Quantity: 10000; Halogen Free: Halogen Free; Voltage Rating: 50V; Packaging: Tape and Reel; Thickness: 0.022inch; Ratings: AEC-Q200; Case/Package: 0402; RoHS Compliant: Yes; Length: 0.039inch; Width: 0.02inch; Case Code (Metric): 1005; Max Operating Temperature: 125°C
C18 = CMP-14477-000099-2: None; Tolerance: 20%; Voltage Rating: 16V; Capacitance: 22uF; Dielectric: X7R; Lead Free: Lead Free; Min Operating Temperature: -55°C; Max Operating Temperature: 125°C; Case/Package: 1206; RoHS Compliant: Yes; Case Code (Metric): 3216; Width: 0.063inch; Case Code (Imperial): 1206; Thickness: 0.071inch; Packaging: Tape and Reel; Length: 0.126inch; Mount: Surface Mount
C19 = CMP-2006-02545-2: as C2 on sheet Sensor_Controller; Lead Free: Lead Free; Max Operating Temperature: 85°C; Case Code (Imperial): 0603; Capacitance: 4.7uF; Width: 0.8mm; Thickness: 0.031inch; Case Code (Metric): 1608; Min Operating Temperature: -55°C; Voltage Rating (DC): 35V; Dielectric: X5R; Voltage: 35V; Packaging: Tape and Reel; Resistor Type: Ceramic; Weight: 0.000222oz; Mount: Surface Mount; Material: Ceramic; Depth: 0.8mm; Tolerance: 10%; REACH SVHC: No SVHC; Case/Package: 0603; Voltage Rating: 35V; Package Quantity: 4000; Height: 0.8mm; Length: 1.6mm; Termination: SMD/SMT
C20 = CMP-1034-02089-3: Chip Multilayer Ceramic Capacitors for General Purpose, 0402, 0.22uF, X7R, 15%, 10%, 16V; Capacitance: 220nF; Depth: 0.5mm; Dielectric: X7R; Min Operating Temperature: -55°C; Package Quantity: 1; Termination: SMD/SMT; Mount: Surface Mount; Radiation Hardening: No; Height: 0.5mm; Case Code (Metric): 1005; Packaging: Tape and Reel; Material: Ceramic; Voltage: 16V; Voltage Rating (DC): 16V; REACH SVHC: No SVHC; Voltage Rating: 16V; Length: 1mm; Tolerance: 10%; Thickness: 0.022inch; Case Code (Imperial): 0402; Max Operating Temperature: 125°C; Width: 0.02inch; Lead Free: Lead Free; Case/Package: 0402
C31 = CMP-06035-008660-1: Ceramic Capacitor for Automotive 1uF ±20% 50VDC X7R 0805 Embossed T/R
C32 = CMP-06035-015979-1: Multilayer Ceramic Capacitors MLCC - SMD/SMT 0805 2.2uF 10%, 25VDC,  X7R 15%
L1 = CMP-06042-017027-1: Multilayer Type Inductor for Power Lines, 0805 (2012), 1μH, 30%, 0.0825Ω, 1.3A; Test Frequency: 1MHz; Shielding: Shielded; Self Resonant Frequency: 50MHz; DC Resistance (DCR): 82.5mR; Inductance: 1uH; Core Material: Ferrite; Inductance Tolerance: 30%; Military Standard: Not; Height - Seated (Max): 0.039inch; Max DC Current: 1.3A; Depth: 1.4mm; Packaging: Tape and Reel; Mount: Surface Mount; Width: 0.049inch; Case Code (Imperial): 0805; RoHS Compliant: Yes; Height: 0.9mm; Case/Package: 0805; Max Operating Temperature: 125°C; Min Operating Temperature: -55°C; REACH SVHC: No SVHC; DC Current: 1.3A; Current Rating: 1.3A; Weight: 0.000194oz; Case Code (Metric): 2012; Termination: SMD/SMT; Length: 2mm; Series: LQM21PN_GR; Tolerance: 30%; Package Quantity: 4000
R8 = CMP-03412-037959-1: RES 200kΩ ±5% 0.063W 0402; Power Rating: 62.5mW; Max Power Dissipation: 63mW; Resistance: 200kR; Temperature Coefficient: 100ppm/°C; Voltage Rating: 50V; Width: 0.5mm; Packaging: Tape and Reel; Termination: SMD/SMT; Case Code (Imperial): 0402; Features: Moisture Resistant; Case/Package: 0402; RoHS Compliant: Yes; Series: AC; Tolerance: 5%; Case Code (Metric): 1005; Height: 0.015inch; Resistor Type: Thick Film; Max Operating Temperature: 155°C; Length: 0.039inch; Number of Terminations: 2; Min Operating Temperature: -55°C
R9 = CMP-04015-107788-1: 44.2kΩ ±1% 0.1W Chip Resistor 0402 Flat Chip (Anti-Sulfuration) AEC-Q200 Qualified; Resistance: 44.2kR; Power Rating: 63mW; Temperature Coefficient: 100ppm/°C; Voltage Rating: 50V; Max Operating Temperature: 155°C; Tolerance: 1%; Height: 0.35mm; Package Quantity: 10000; Length: 1mm; Case Code (Imperial): 0402; Packaging: Tape and Reel; Min Operating Temperature: -55°C; Width: 0.5mm; Case/Package: 0402; Case Code (Metric): 1005; Weight: 2.3E-05oz; Termination: SMD/SMT
R32 = CMP-2002-00484-1: Manufacturer: Panasonic; Part Number: ERJ-2GEJ204X
R33 = CMP-02407-005152-1: RES Thick Film, 50kΩ, 1%, 0.063W, 100ppm/°C, 0402; Power Rating: 63mW; Voltage Rating: 50V; Resistance: 50kR; Package Quantity: 10000; Case/Package: 0402; Max Operating Temperature: 155°C; Case Code (Metric): 1005; Termination: SMD/SMT; Lead Free: Lead Free; Height: 0.35mm; Width: 0.5mm; Packaging: Tape and Reel; Min Operating Temperature: -55°C; Length: 1mm; Tolerance: 1%; Case Code (Imperial): 0402; Weight: 2.3E-05oz
R34 = CMP-2002-06970-1: Manufacturer: Yageo; Part Number: RC0402JR-100RL
U6 = AP62200WU-7: No Description Available; Manufacturer_Name: Diodes Inc; Copyright: Copyright (C) 2026 Ultra Librarian. All rights reserved.; Manufacturer_Part_Number: AP62200WU-7; RefDes: RefDes; Type: Type
U8 = CMP-12756-000036-1: IC REG LINEAR 3.3V 300MA SOT23-3; Accuracy: 1%; Max Input Voltage: 13.2V; Number of Outputs: 1; Polarity: Positive; Power Supply Rejection Ratio (PSRR): 75dB; Quiescent Current: 150uA; Min Input Voltage: 2.5V; Output Type: Fixed; Dropout Voltage: 250mV; Height: 1.3mm; Weight: 0.000282oz; Packaging: Tape and Reel; Length: 3.02mm; Width: 1.7mm; Max Operating Temperature: 125°C; Output Voltage: 3.3V; Min Operating Temperature: -40°C; Output Current: 300mA; Number of Pins: 3; Number of Regulators: 1; Max Output Current: 300mA; Mount: Surface Mount; Case/Package: SOT-23-3; Package Quantity: 3000

## Nets that join several sheets
3V3: Sensor_Controller (13 pins), IR_Sensor (7 pins), comms_interface (C5.1 R5.1 U5.8), Power (C32.1 U8.2)
GND: Sensor_Controller (15 pins), IR_LED (Q1.2 R27.1 R28.1 U9#1.4), IR_Sensor (19 pins), comms_interface (7 pins), Power (8 pins)
LED Power: IR_LED (CR3.2 U9#1.2), Power (C9.1 C18.1 L1.2 R8.2)
VIN: comms_interface (J?.3), Power (5 pins)
ADC1 IN0: Sensor_Controller (U1.7), IR_Sensor (C37.2 R45.2)
ADC1 IN1: Sensor_Controller (U1.8), IR_Sensor (C38.2 R46.2)
PWM LED: Sensor_Controller (U1.18), IR_LED (Q1.1 R27.2)
RX: Sensor_Controller (U1.21), comms_interface (U5.1)
TX: Sensor_Controller (U1.19), comms_interface (U5.4)
TX EN: Sensor_Controller (U1.23), comms_interface (R5.2 U5.3)